# EAGLE design SmHodule-V05 (EAGLE 7.2.0)
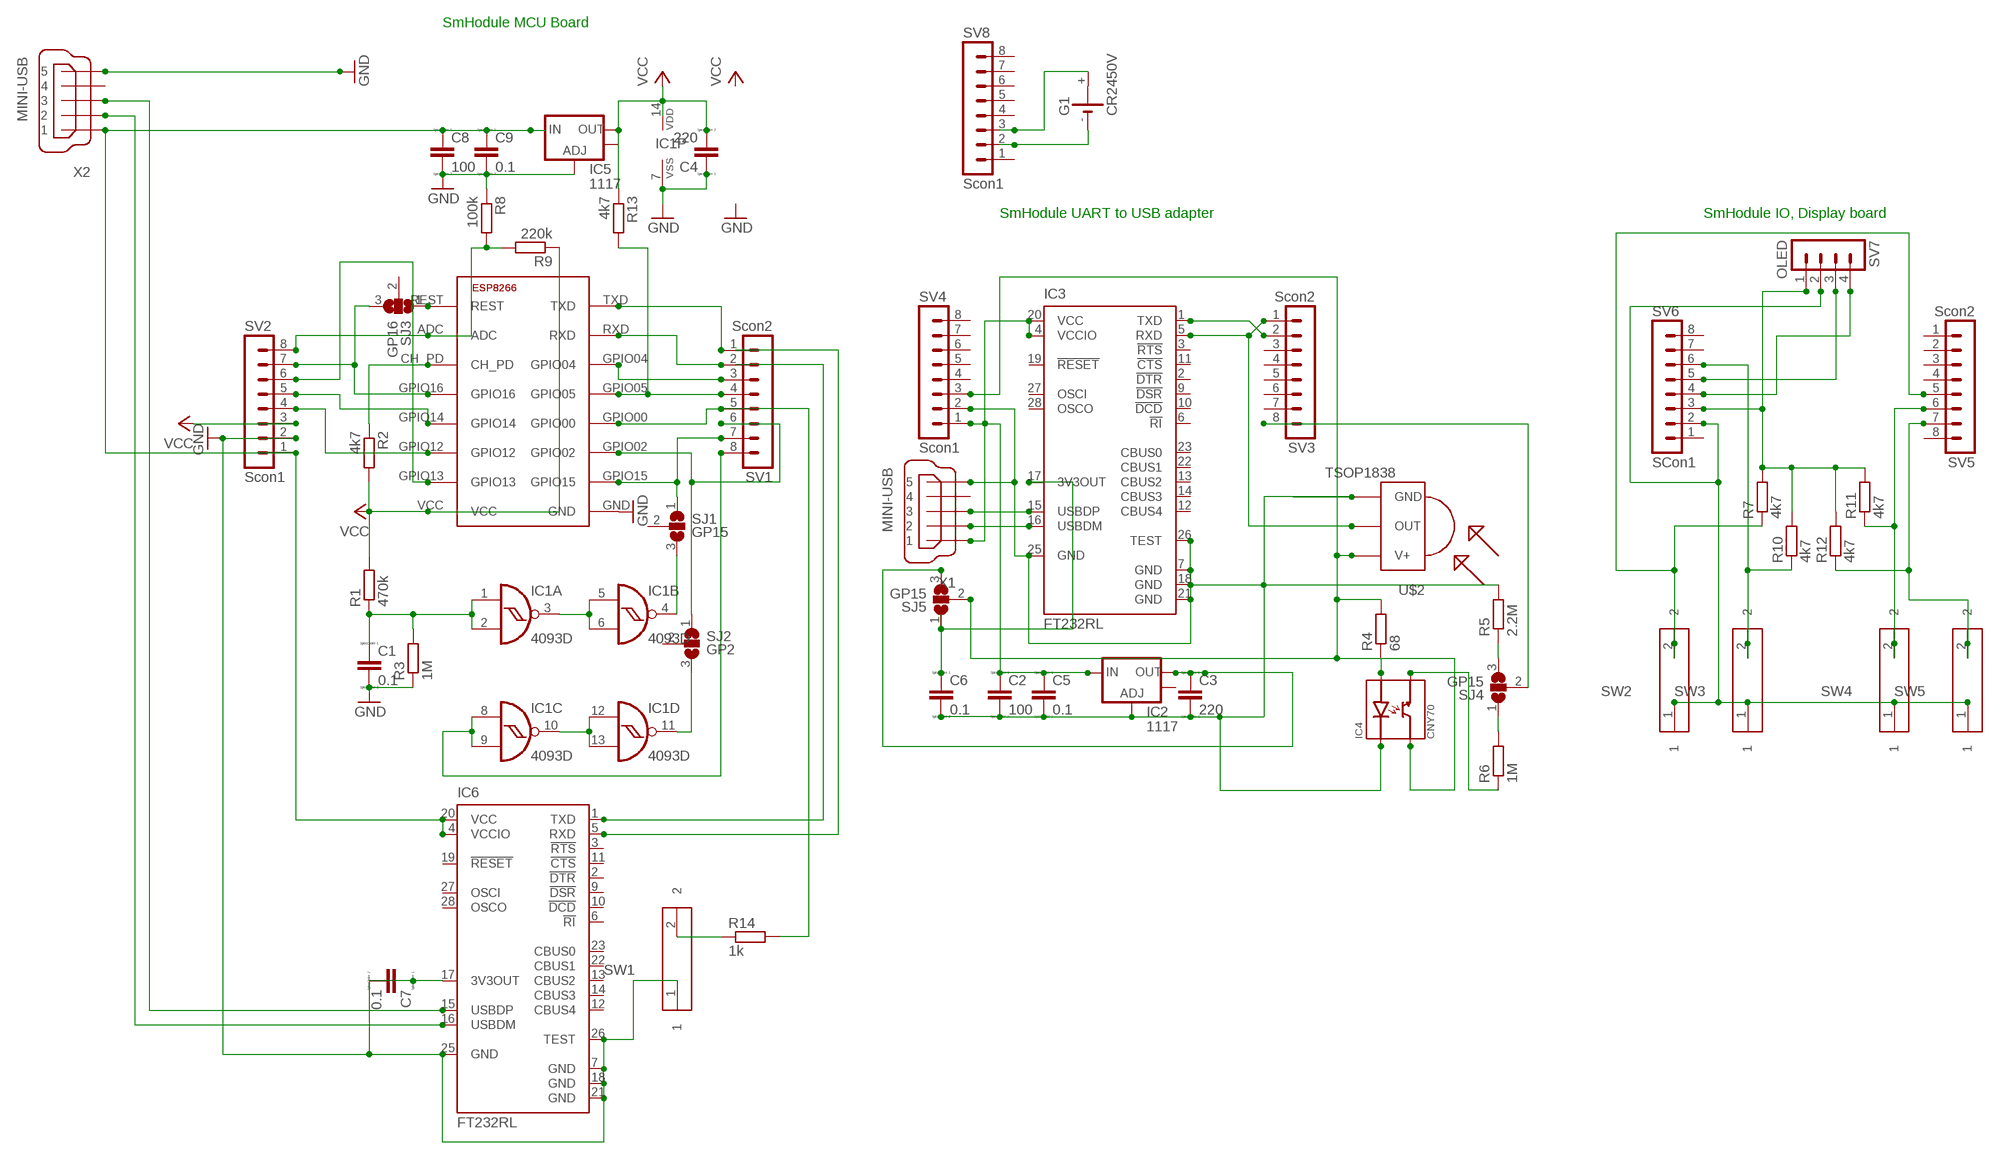
[diagram p0: schematic, sheet 1]

## Parts
C1  0.1  C  [C0805]
C2  100  CC1210  [C1210]
C3  220  CC1210  [C1210]
C4  220  CC1210  [C1210]
C5  0.1  C  [C0805]
C6  0.1  C  [C0805]
C7  0.1  C  [C0805]
C8  100  CC1210  [C1210]
C9  0.1  C  [C0805]
G1  CR2450V  [CR2450V]
IC1  4093D  [SO14]
IC2  1117  V_REG_LM1117SOT223  [SOT223]
IC3  FT232RL  [SSOP28]
IC4  CNY70  [CNY70]
IC5  1117  V_REG_LM1117SOT223  [SOT223]
IC6  FT232RL  [SSOP28]
R1  470k  R-EU_R0603  [R0603]
R2  4k7  R-EU_R0603  [R0603]
R3  1M  R-EU_R0603  [R0603]
R4  68  R-EU_R0603  [R0603]
R5  2.2M  R-EU_R0603  [R0603]
R6  1M  R-EU_R0603  [R0603]
R7  4k7  R-EU_R0603  [R0603]
R8  100k  R-EU_R0603  [R0603]
R9  220k  R-EU_R0603  [R0603]
R10  4k7  R-EU_R0603  [R0603]
R11  4k7  R-EU_R0603  [R0603]
R12  4k7  R-EU_R0603  [R0603]
R13  4k7  R-EU_R0603  [R0603]
R14  1k  R-EU_R0603  [R0603]
SJ1  GP15  SJ2W  [SJ_2]
SJ2  GP2  SJ2W  [SJ_2]
SJ3  GP16  SJ2W  [SJ_2]
SJ4  GP15  SJ2W  [SJ_2]
SJ5  GP15  SJ2W  [SJ_2]
SV1  Scon2  MA08-1  [MA08-1]
SV2  Scon1  MA08-1  [MA08-1]
SV3  Scon2  MA08-1  [MA08-1]
SV4  Scon1  MA08-1  [MA08-1]
SV5  Scon2  MA08-1  [MA08-1]
SV6  SCon1  MA08-1  [MA08-1]
SV7  OLED  MA04-1  [MA04-1]
SV8  Scon1  MA08-1  [MA08-1]
SW1  434111043826  [434111043826]
SW2  434111043826  [434111043826]
SW3  434111043826  [434111043826]
SW4  434111043826  [434111043826]
SW5  434111043826  [434111043826]
U$1  ESP1  ESP8266ESP-12  [ESP-12]
U$2  TSOP1838  [TSOP18XX]
X1  MINI-USB  MINI-USB-SHIELD-UX60-MB-5ST  [UX60-MB-5ST]
X2  MINI-USB  MINI-USB-SHIELD-UX60-MB-5ST  [UX60-MB-5ST]

## Nets
GND: C1.2 C4.1 C7.2 C8.2 C9.2 IC1.7(P:VSS) IC5.1(ADJ) IC6.7(GND) IC6.18(GND) IC6.21(GND) IC6.25(GND) IC6.26(TEST) R3.1 R8.1 SV2.2 SW1.1 U$1.GND X2.5
N$1: C1.1 IC1.1(A:I0) IC1.2(A:I1) R1.1 R3.2
N$2: IC1.3(A:O) IC1.5(B:I0) IC1.6(B:I1)
N$3: IC3.1(TXD) SV3.2
N$4: IC1.10(C:O) IC1.12(D:I0) IC1.13(D:I1)
N$6: IC1.4(B:O) SJ1.3
N$7: SV1.1 U$1.TXD
N$8: SV1.2 U$1.RXD
N$9: SV2.6 U$1.GPIO13
N$10: R14.2 SV1.5 U$1.GPIO00
N$11: SV2.4 U$1.GPIO12
N$12: SV2.5 U$1.GPIO14
N$13: SV1.3 U$1.GPIO04
N$14: R13.2 SV1.4 U$1.GPIO05
N$15: SJ3.3 SV2.7 U$1.GPIO16
N$16: R6.2 SJ4.1
N$17: R8.2 R9.2 SV2.8 U$1.ADC
N$18: R2.1 U$1.CH_PD
N$20: SJ1.1 SV1.7 U$1.GPIO15
N$21: IC3.5(RXD) SV3.1 U$2.OUT
N$22: C2.2 C3.2 C5.2 C6.2 IC2.1(ADJ) IC3.7(GND) IC3.18(GND) IC3.21(GND) IC3.25(GND) IC3.26(TEST) IC4.EK R5.2 SV4.2 U$2.GND X1.5
N$23: IC1.11(D:O) SJ2.3
N$24: SJ2.1 SV1.6 U$1.GPIO02
N$25: SJ3.1 U$1.REST
N$26: IC1.8(C:I0) IC1.9(C:I1) SV1.8
N$27: IC4.DC R4.2 SJ5.2 SV4.3 U$2.VCC(V+)
N$28: C2.1 C5.1 IC2.3(IN) IC3.4(VCCIO) IC3.20(VCC) SV4.1 X1.1
N$30: R7.2 R10.2 R11.2 R12.2 SV6.3 SV7.1
N$31: R11.1 SV5.6 SW4.2
N$33: IC4.DE R6.1
N$34: R5.1 SJ4.3
N$35: SV6.5 SV7.3
N$36: R10.1 SV6.6 SW3.2
N$37: R14.1 SW1.2
N$38: IC4.EA R4.1
N$39: IC3.16(USBDM) X1.2
N$40: IC3.15(USBDP) X1.3
N$41: C6.1 IC3.17(3V3OUT) SJ5.1
N$42: R7.1 SV5.5 SW2.2
N$43: SV6.4 SV7.4
N$44: R12.1 SV5.7 SW5.2
N$46: C3.1 IC2.2(OUT) SJ5.3
N$47: SV6.2 SV7.2 SW2.1 SW3.1 SW4.1 SW5.1
N$52: SJ4.2 SV3.8
N$54: G1.- SV8.2
N$55: G1.+ SV8.3
N$57: C8.1 C9.1 IC5.3(IN) IC6.4(VCCIO) IC6.20(VCC) SV2.1 X2.1
N$60: IC6.1(TXD)
N$62: IC6.5(RXD)
N$64: IC6.15(USBDP) X2.3
N$65: IC6.16(USBDM) X2.2
N$66: C7.1 IC6.17(3V3OUT)
VCC: C4.2 IC1.14(P:VDD) IC5.2(OUT) IC5.4(OUT) R1.2 R2.2 R9.1 R13.1 SV2.3 U$1.VCC
Unconnected: G1.+@1(+) IC2.4(OUT) IC3.2(!DTR) IC3.3(!RTS) IC3.6(!RI) IC3.9(!DSR) IC3.10(!DCD) IC3.11(!CTS) IC3.12(CBUS4) IC3.13(CBUS2) IC3.14(CBUS3) IC3.19(!RESET) IC3.22(CBUS1) IC3.23(CBUS0) IC3.27(OSCI) IC3.28(OSCO) IC6.2(!DTR) IC6.3(!RTS) IC6.6(!RI) IC6.9(!DSR) IC6.10(!DCD) IC6.11(!CTS) IC6.12(CBUS4) IC6.13(CBUS2) IC6.14(CBUS3) IC6.19(!RESET) IC6.22(CBUS1) IC6.23(CBUS0) IC6.27(OSCI) IC6.28(OSCO) SJ1.2 SJ2.2 SJ3.2 SV3.3 SV3.4 SV3.5 SV3.6 SV3.7 SV4.4 SV4.5 SV4.6 SV4.7 SV4.8 SV5.1 SV5.2 SV5.3 SV5.4 SV5.8 SV6.1 SV6.7 SV6.8 SV8.1 SV8.4 SV8.5 SV8.6 SV8.7 SV8.8 X1.4 X1.M1(S1) X1.M2(S2) X1.M3(S3) X1.M4(S4) X2.4 X2.M1(S1) X2.M2(S2) X2.M3(S3) X2.M4(S4)

## Notes on the sheet
- SmHodule MCU Board
- SmHodule UART to USB adapter | SmHodule IO, Display board

## Library data of the parts
C1-C9 = ESP07_CUSTOM:C: CAPACITOR, European symbol; SPICEMODEL: NONE; SPICEPREFIX: C
G1 = battery:CR2450V: LI BATTERY Varta
IC1 = 40xx:4093: Quad 2-input NAND schmitt trigger
IC2 IC5 = ESP07_CUSTOM:V_REG_LM1117: Voltage Regulator LM1117 Standard adjustable voltage regulator but in SMD form. Spark Fun Electronics SKU : COM-00595; PROD_ID: VREG-08170
IC3 IC6 = ftdichip:FT232R: Source: http://www.ftdichip.com/Documents/DataSheets/DS_FT232R_v104.pdf; MPN: FT232RL; OC_FARNELL: 1146032; OC_NEWARK: 91K9918
IC4 = CNY70:CNY70: CNY70 (Vishay) Reflexkoppler
R1-R14 = ESP07_CUSTOM:R-EU_: RESISTOR, European symbol
SJ1-SJ5 = ESP07_CUSTOM:SJ2W: SMD solder JUMPER
SV1-SV6 SV8 = ESP07_CUSTOM:MA08-1: PIN HEADER; OC_FARNELL: unknown; OC_NEWARK: unknown
SV7 = con-lstb:MA04-1: PIN HEADER; OC_FARNELL: unknown; OC_NEWARK: unknown
SW1-SW5 = Kurzhubtaster:434111043826: WS-TRS-6x3.5 mm SMD Tact Switch, 2 pins
U$1 = ESP8266-12:ESP8266: low cost Wifi to Serial Module
U$2 = tsop:TSOP1838: IR Receiver and Demodulator
X1 X2 = con-hirose:MINI-USB-SHIELD-: MINI USB Connector Source: http://www.hirose.co.jp/cataloge_hp/e24000019.pdf; OC_FARNELL: unknown; OC_NEWARK: unknown

## Board
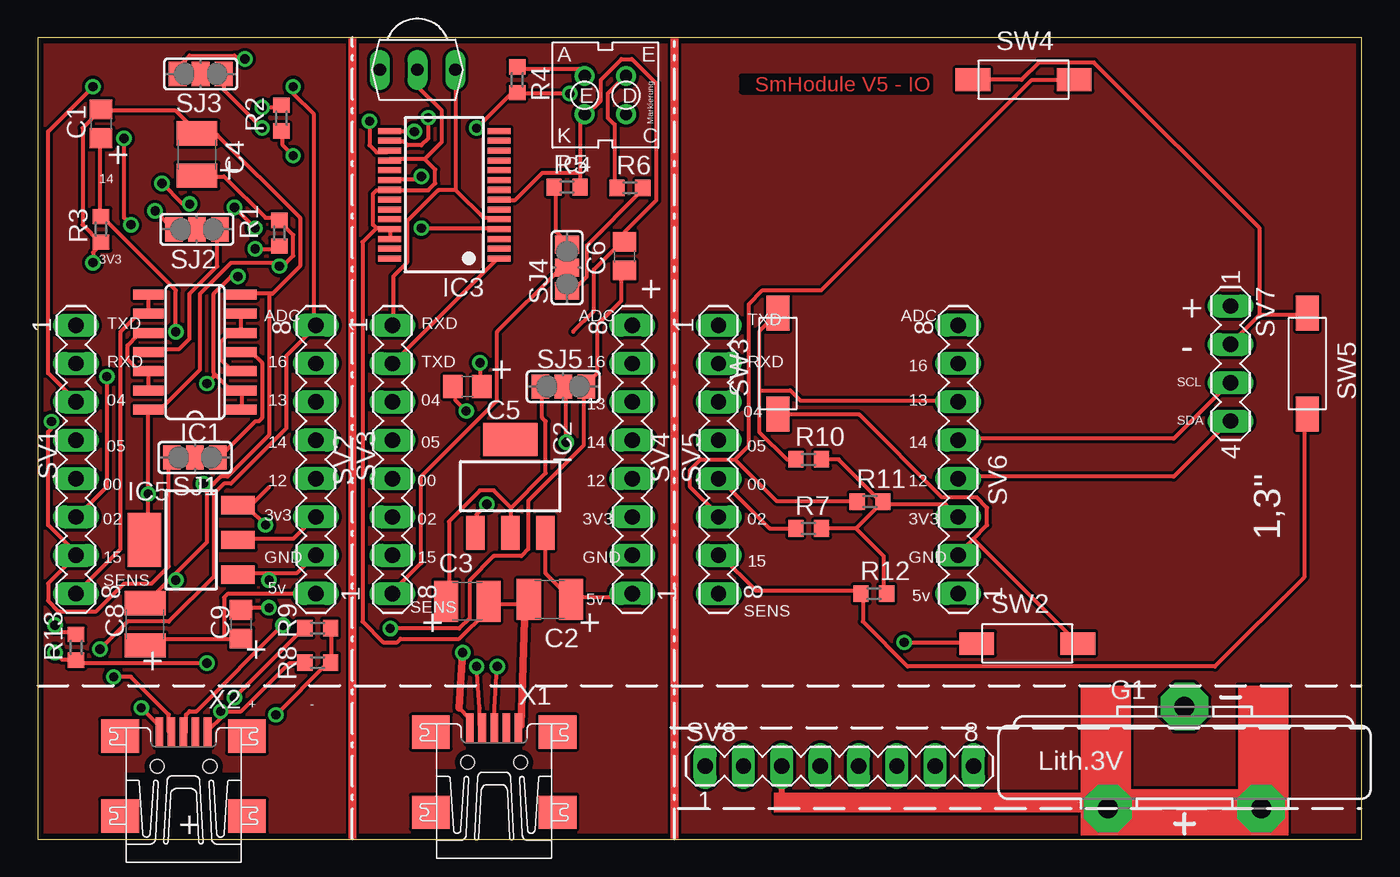
[diagram p1: board, top side]
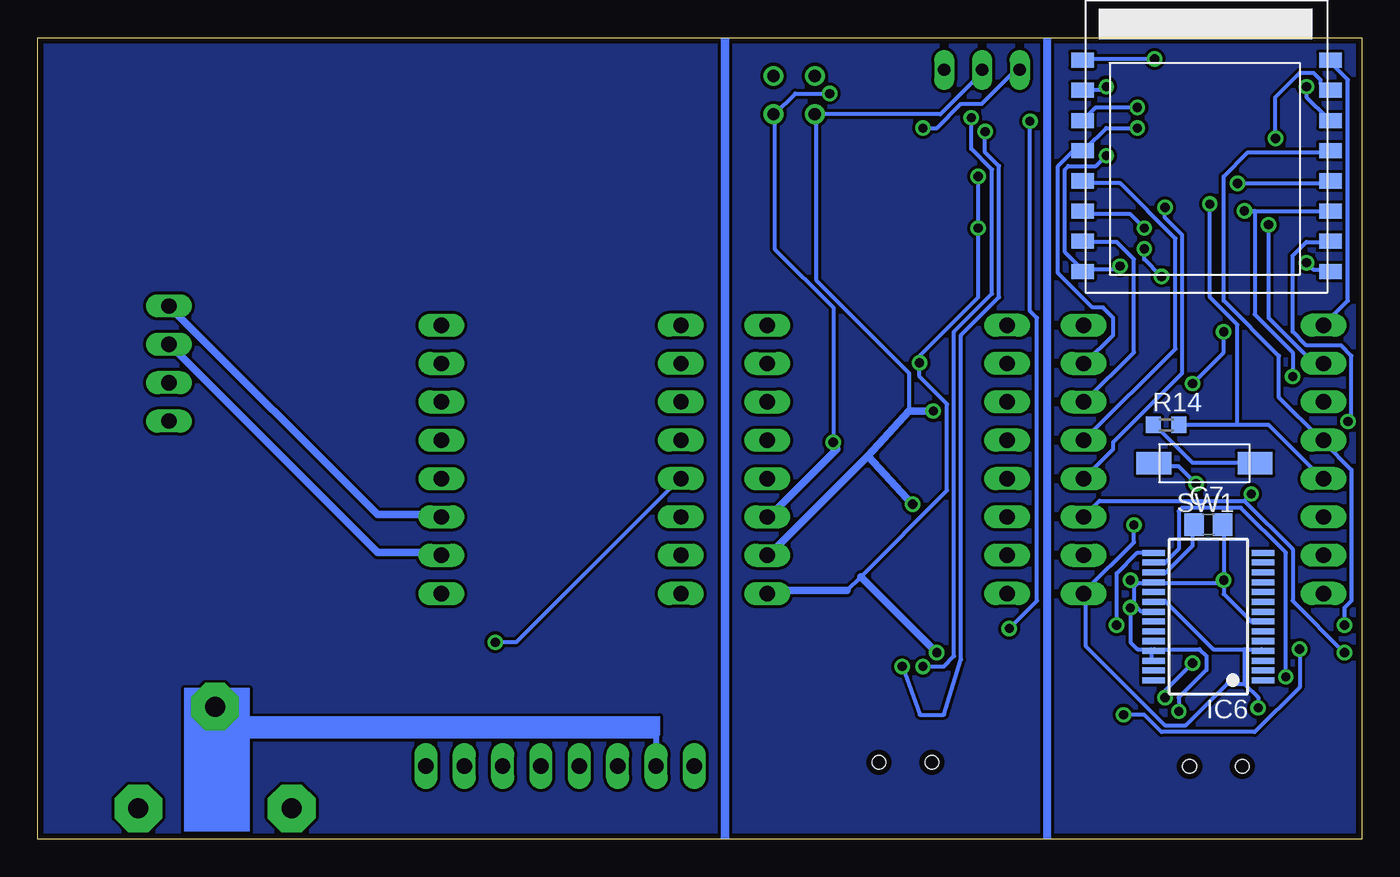
[diagram p2: board, bottom side, seen from below]

Size 87.68 x 53.08 mm. Coordinates in mm from the lower left corner, seen from the top.
Outline: 0,0 87.68,0 87.68,53.08 0,53.08 0,0
Copper layers (1*16): Top 0.0025mm / dielectric 1.5mm / Bottom 0.0025mm
Design rules "default *": minimum track width 10mil, minimum drill 24mil, track to track 8mil, track to pad 8mil, pad to pad 8mil, via to via 8mil, smd to smd 8mil, copper to edge 15mil, drill to drill 8mil, minimum pad ring 10mil, minimum via ring 8mil, stop-mask expansion 4mil, vias tented up to drill 0mil, thermal gap 10mil

### Footprints (pad centres in the part's own frame; a part is rotated, then mirrored left to right if it is on the bottom)
C0805 = smd 1.3 x 1.5: 1 -0.95,0; 2 0.95,0
C1210 = smd 1.6 x 2.7: 1 -1.4,0; 2 1.4,0
CR2450V = drill 1.321 pad 3.15 octagon: + -2.54,-5.08; +@1 -2.54,5.08; - 4.191,0
SO14 = smd 0.66 x 2.032: 1 -3.81,-3.073; 2 -2.54,-3.073; 3 -1.27,-3.073; 4 0,-3.073; 5 1.27,-3.073; 6 2.54,-3.073; 7 3.81,-3.073; 8 3.81,3.073; 9 2.54,3.073; 10 1.27,3.073; 11 0,3.073; 12 -1.27,3.073; 13 -2.54,3.073; 14 -3.81,3.073
SOT223 = smd 1.219 x 2.235: 1 -2.311,-3.099; 2 0,-3.099; 3 2.311,-3.099 | smd 3.6 x 2.2: 4 0,3.099
SSOP28 = smd 0.4 x 1.5: 1 -4.225,-3.625; 2 -3.575,-3.625; 3 -2.925,-3.625; 4 -2.275,-3.625; 5 -1.625,-3.625; 6 -0.975,-3.625; 7 -0.325,-3.625; 8 0.325,-3.625; 9 0.975,-3.625; 10 1.625,-3.625; 11 2.275,-3.625; 12 2.925,-3.625; 13 3.575,-3.625; 14 4.225,-3.625; 15 4.225,3.625; 16 3.575,3.625; 17 2.925,3.625; 18 2.275,3.625; 19 1.625,3.625; 20 0.975,3.625; 21 0.325,3.625; 22 -0.325,3.625; 23 -0.975,3.625; 24 -1.625,3.625; 25 -2.275,3.625; 26 -2.925,3.625; 27 -3.575,3.625; 28 -4.225,3.625
CNY70 = drill 0.813: DC 1.37,-1.27; DE 1.37,1.27; EA -1.37,1.27; EK -1.37,-1.27
R0603 = smd 1 x 1.1: 1 -0.85,0; 2 0.85,0
SJ_2 = smd 1.168 x 1.6: 1 -1.524,0; 2 0,0; 3 1.524,0
MA08-1 = drill 1.016 long: 1 -8.89,0; 2 -6.35,0; 3 -3.81,0; 4 -1.27,0; 5 1.27,0; 6 3.81,0; 7 6.35,0; 8 8.89,0
MA04-1 = drill 1.016 long: 1 -3.81,0; 2 -1.27,0; 3 1.27,0; 4 3.81,0
434111043826 = smd 2.3 x 1.5: 1 -3.35,0; 2 3.35,0
ESP-12 = smd 1 x 1.5: ADC 4,-0.2; CH_PD 6,-0.2; GND 16,16.21; GPIO00 10,16.21; GPIO02 12,16.21; GPIO04 6,16.21; GPIO05 8,16.21; GPIO12 12,-0.2; GPIO13 14,-0.2; GPIO14 10,-0.2; GPIO15 14,16.21; GPIO16 8,-0.2; REST 2,-0.2; RXD 4,16.21; TXD 2,16.21; VCC 16,-0.2
TSOP18XX = drill 0.813 long: GND -0.001,-0.027; OUT -2.501,-0.027; VCC 2.499,-0.027
UX60-MB-5ST = smd 2 x 0.5: 1 2.25,1.6; 2 2.25,0.8; 3 2.25,0; 4 2.25,-0.8; 5 2.25,-1.6 | smd 2.2 x 2.5: M1 -3.3,-4.2; M2 -3.3,4.2; M3 2,4.2; M4 2,-4.2 | hole 0.9: 0,-1.75; 0,1.75

### Placement (x,y rotation side)
C1  4.19,47.37 90 top
C2  33.91,15.87 180 top
C3  28.45,15.75 0 top
C4  10.54,45.34 270 top
C5  28.45,29.97 180 top
C6  38.86,38.61 90 top
C7  10.16,20.83 0 bottom
C8  7.11,14.22 90 top
C9  13.46,14.22 90 top
G1  75.95,4.57 90 top
IC1  10.41,32.26 90 top
IC2  31.29,23.37 0 top
IC3  26.92,42.67 90 top
IC4  37.59,49.28 0 top
IC5  10.16,19.81 90 top
IC6  10.16,14.73 90 bottom
R1  16,40.13 90 top
R2  16.13,47.75 270 top
R3  4.19,40.39 90 top
R4  31.75,50.29 270 top
R5  35.05,43.18 0 top
R6  39.22,43.13 0 top
R7  51.05,20.57 0 top
R8  18.54,11.68 0 top
R9  18.54,13.97 0 top
R10  51.05,25.15 0 top
R11  55.12,22.35 0 top
R12  55.37,16.26 0 top
R13  2.54,12.7 90 top
R14  12.95,27.43 0 bottom
SJ1  10.41,25.27 0 top
SJ2  10.54,40.39 0 top
SJ3  10.79,50.67 0 top
SJ4  35.05,37.85 90 top
SJ5  34.8,29.97 180 top
SV1  2.54,25.15 270 top
SV2  18.41,25.15 90 top
SV3  23.5,25.15 270 top
SV4  39.37,25.15 90 top
SV5  45.09,25.15 270 top
SV6  60.96,25.15 90 top
SV7  78.99,31.5 270 top
SV8  53.09,4.83 0 top
SW1  10.41,24.89 0 bottom
SW2  65.53,12.95 180 top
SW3  49.02,31.5 90 top
SW4  65.28,50.29 0 top
SW5  84.07,31.5 270 top
U$1  18.29,53.59 270 bottom
U$2  25.15,50.93 180 top
X1  30.23,5.08 90 top
X2  9.65,4.83 90 top

### Tracks (layer width: path | path; a pad name or v marks a point on that pad's centre or on a via)
GND  (via drill 0.61)
  Top 0.254: 12.34,8.23 11.2,7.09 X2.5 | 12.34,8.23 12.57,8.46 13.49,8.46 16.69,11.66 17.6,11.66 R8.1 | 15.32,17.6 17.14,17.6 18.29,18.75 SV2.2 | 15.32,17.6 13.26,17.6 IC5.1 | v15.32,15.32 13.49,15.32 C9.2 | v15.32,17.14 15.32,17.6 | v12.12,8.46 12.34,8.23 | v3.66,38.18 3.66,38.86 4.12,39.32 R3.1 4.12,39.55 2.97,40.69 2.97,47.09 4.12,48.23 C1.2 4.34,48.23 9.14,48.23 10.52,46.86 C4.1 10.74,46.63 11.89,46.63 17.37,41.15 17.37,37.95 15.54,36.12 15.32,36.12 | 15.32,36.12 13.49,36.12 IC1.7 | 8.91,17.37 11.2,19.66 11.2,23.09 11.66,23.55 | 8.91,17.37 7.32,15.77 C8.2 | 11.66,23.55 12.12,24 12.57,24 15.32,26.75 15.32,36.12 | 8.91,17.37 v9.14,17.14 | 11.66,23.55 v10.97,23.55
  Bottom 0.254: IC6.26 13.95,11.89 13.95,12.34 IC6.25 | 15.09,15.54 14.63,15.09 13.95,15.09 IC6.21 | 15.09,15.54 15.09,16.69 14.86,16.92 | 14.86,16.92 13.95,16.92 IC6.18 13.72,16.92 9.14,16.92 | 15.09,15.54 v15.32,15.32 15.32,13.03 14.86,12.57 13.95,12.57 IC6.25 | 9.14,16.92 v9.14,17.14 9.14,20.8 C7.2 | 9.14,16.92 9.14,16.23 7.32,14.4 6.63,14.4 IC6.7 | v15.32,17.14 15.09,17.14 14.86,16.92 | v12.12,8.46 12.12,9.37 10.29,11.2 10.29,12.12 10.74,12.57 13.72,12.57 IC6.25 | v3.66,38.18 3.2,37.72 2.29,37.72 U$1.GND | v10.97,23.55 12.12,24.69 13.72,24.69 SW1.1
N$1  (via drill 0.61)
  Top 0.254: IC1.1 13.51,28.57 13.51,29.72 IC1.2 12.8,29.72 11.66,30.86 | C1.1 4.12,46.41 4.12,41.38 R3.2 4.34,41.15 9.14,36.35 v9.14,33.6 | v14.4,39.09 16,39.09 R1.1 | v13.26,37.26 12.8,37.26 11.66,36.12 11.66,30.86 | v11.2,30.18 11.66,30.63 11.66,30.86
  Bottom 0.254: v14.4,39.09 14.4,38.41 v13.26,37.26 | v9.14,33.6 9.14,32.23 v11.2,30.18
N$2
  Top 0.254: IC1.3 13.49,31.09 12.8,31.09 12.12,31.77 12.12,32.92 12.57,33.38 13.49,33.38 IC1.5 IC1.6
N$3
  Top 0.254: SV3.2 30.4,38.41 IC3.1
N$4
  Top 0.254: IC1.13 7.32,29.72 7.32,30.86 IC1.12 7.32,31.09 6.63,31.09 5.94,31.77 5.94,32.69 6.63,33.38 7.32,33.38 IC1.10
N$6
  Top 0.254: SJ1.3 12.12,25.38 14.4,27.66 14.63,27.66 14.86,27.89 14.86,31.55 14.17,32.23 13.49,32.23 IC1.4
N$7
  Bottom 0.254: SV1.1 0.91,35.66 0.91,50.29 2.06,51.44 U$1.TXD
N$8  (via drill 0.61)
  Top 0.254: v5.71,46.41 5.71,41.15 v6.17,40.69
  Bottom 0.254: v5.71,46.41 5.71,49.15 4.12,50.75 3.2,50.75 2.74,50.29 2.74,50.06 2.29,49.61 U$1.RXD | v6.17,40.69 6.17,34.52 3.2,31.55 2.74,31.55 SV1.2
N$9
  Bottom 0.254: U$1.GPIO13 18.29,39.55 16.23,39.55 15.09,38.41 15.09,32.23 18.29,29.03 SV2.6
N$10  (via drill 0.61)
  Top 0.254: v8.23,43.43 9.6,42.06 v10.06,42.06
  Bottom 0.254: v8.23,43.43 2.29,43.43 U$1.GPIO00 | 8.23,27.43 6.17,27.43 2.74,24 SV1.5 | 8.23,27.43 R14.2 | v10.06,42.06 10.06,35.89 8.23,34.06 8.23,27.43
N$11  (via drill 0.61)
  Top 0.254: v13.03,41.83 v14.4,40.46
  Bottom 0.254: v14.4,40.46 15.32,41.38 18.29,41.38 U$1.GPIO12 | v13.03,41.83 13.03,41.15 11.89,40.01 11.89,30.86 16.46,26.29 16.46,25.83 SV2.4
N$12
  Bottom 0.254: U$1.GPIO14 18.29,43.43 16,43.43 12.34,39.78 12.34,32.46 18.29,26.52 SV2.5
N$13  (via drill 0.61)
  Top 0.254: v3.66,49.84 0.69,46.86 0.69,30.86 2.52,29.03 SV1.3
  Bottom 0.254: v3.66,49.84 3.66,49.15 2.29,47.78 U$1.GPIO04
N$14  (via drill 0.61)
  Top 0.254: v1.14,14.17 1.6,13.72 2.52,13.72 R13.2
  Bottom 0.254: v1.14,14.17 1.14,15.32 0.69,15.77 0.69,24.46 2.52,26.29 SV1.4 2.74,26.52 5.49,29.26 5.49,32 9.14,35.66 9.14,43.89 7.54,45.49 2.29,45.49 U$1.GPIO05
N$15  (via drill 0.61)
  Top 0.254: v14.86,47.09 12.34,49.61 12.34,50.52 SJ3.3
  Bottom 0.254: SV2.7 18.29,31.55 16.46,33.38 16.46,34.52 17.14,35.2 17.83,35.2 20.12,37.49 20.12,44.58 19.2,45.49 18.52,45.49 U$1.GPIO16 18.29,45.72 16.92,47.09 v14.86,47.09
N$16
  Top 0.254: R6.2 40.03,42.98 36.37,39.32 36.37,37.26 35.23,36.12 SJ4.1
N$17  (via drill 0.61)
  Top 0.254: R9.2 19.43,13.95 19.43,11.89 R8.2 19.2,11.66 v15.77,8.23 | v16.92,49.84 16.92,49.38 18.29,48.01 18.29,34.06 SV2.8 18.29,33.83 16.46,32 16.46,27.2 12.8,23.55 12.34,23.55 11.66,22.86 11.66,17.37 8.69,14.4 5.94,14.4 v4.12,12.57
  Bottom 0.254: v16.92,49.84 17.14,49.61 18.29,49.61 U$1.ADC | v15.77,8.23 14.4,8.23 13.26,7.09 7.09,7.09 4.12,10.06 v4.12,12.57
N$18  (via drill 0.61)
  Top 0.254: v14.86,48.46 16,48.46 R2.1
  Bottom 0.254: v14.86,48.46 17.6,48.46 18.29,47.78 U$1.CH_PD
N$20  (via drill 0.61)
  Top 0.254: v0.91,27.66 0.91,27.2 0.69,26.98 0.69,20.8 2.52,18.97 SV1.7 2.52,18.75 0.69,16.92 0.69,15.77 1.37,15.09 3.89,15.09 5.71,16.92 7.54,16.92 8.69,18.06 8.69,25.15 SJ1.1
  Bottom 0.254: v0.91,27.66 0.69,27.89 0.69,32 1.37,32.69 3.66,32.69 4.57,33.6 4.57,38.63 3.66,39.55 2.29,39.55 U$1.GPIO15
N$21
  Top 0.254: 27.69,42.98 29.52,41.15 30.43,41.15 IC3.5 | 27.69,42.98 27.69,50.75 U$2.OUT | 27.69,42.98 26.52,42.98 24.46,40.92 24.46,38.18 23.55,37.26 23.55,34.06 SV3.1
N$22  (via drill 0.61)
  Top 0.254: v28.37,28.35 27.69,29.03 27.69,29.95 C5.2 | v29.74,22.17 29.06,21.49 29.06,20.34 IC2.1 | 35.46,33.6 36.83,34.98 36.83,37.72 38.66,39.55 C6.2 38.89,39.78 38.89,40.23 40.95,42.29 40.95,50.06 39.34,51.66 38.66,51.66 37.29,50.29 37.29,48.92 36.37,48.01 IC4.EK 36.14,48.01 35.92,47.78 35.92,44.12 | 35.92,44.12 35.92,43.2 R5.2 | 35.92,44.12 33.4,44.12 31.57,42.29 30.66,42.29 IC3.7 | 32.26,15.54 32.49,15.77 C2.2 32.26,15.54 | 32,7.54 X1.5 | 32.26,15.54 29.97,15.54 C3.2 29.74,15.54 29.74,15.09 27.91,13.26 24.03,13.26 23.8,13.03 22.89,13.03 21.51,14.4 21.51,39.55 22.43,40.46 | IC3.26 23.34,39.78 23.34,40.23 IC3.25 23.11,40.46 22.43,40.46 | 22.43,40.46 22.2,40.69 22.2,42.75 22.43,42.98 23.11,42.98 IC3.21 23.34,42.98 25.86,42.98 26.31,43.43 26.31,44.35 25.63,45.03 | 25.63,45.03 23.34,45.03 IC3.18 | 25.63,45.03 26.77,46.18 26.77,48.23 25.17,49.84 25.17,50.75 U$2.GND
  Top 0.5: 32.26,15.54 32,7.54
  Bottom 0.254: 39.09,18.97 SV4.2 | 29.97,28.35 29.97,30.86 36.14,37.03 36.14,48.01 | 36.14,48.01 27.91,48.01 25.17,50.75 U$2.GND | 36.14,48.01 IC4.EK
  Bottom 0.5: v28.37,28.35 29.97,28.35 32.69,25.38 | 39.09,18.97 32.69,25.38 | 32.69,25.38 v29.74,22.17
N$23
  Top 0.254: SJ2.3 11.89,40.23 11.89,37.95 10.06,36.12 10.06,33.15 9.37,32.46 7.54,32.46 IC1.11
N$24  (via drill 0.61)
  Top 0.254: v7.77,41.6 8.91,40.46 SJ2.1 | v4.57,30.63 4.57,23.32 2.74,21.49 SV1.6
  Bottom 0.254: v7.77,41.6 7.09,41.6 | 7.09,41.6 2.29,41.6 U$1.GPIO02 | v4.57,30.63 4.57,32.23 7.09,34.75 7.09,41.6
N$25  (via drill 0.61)
  Top 0.254: v13.72,51.66 13.26,51.66 13.03,51.89 10.06,51.89 9.37,51.21 9.37,50.75 SJ3.1
  Bottom 0.254: v13.72,51.66 18.29,51.66 U$1.REST
N$26
  Top 0.254: IC1.8 7.32,35.89 7.32,34.98 IC1.9 7.32,34.75 6.63,34.75 5.49,33.6 5.49,19.2 SV1.8
N$27  (via drill 0.61)
  Top 0.254: v35,26.29 35,29.95 SJ5.2 | v35.23,49.38 31.8,49.38 R4.2 31.57,49.61 v29.06,47.09
  Top 0.406: 33.02,29.97 SJ5.2
  Bottom 0.254: 34.75,25.83 v35,26.29 35,35.2 38.89,39.09 38.89,48.01 | 39.09,21.49 SV4.3 | v35.23,49.38 37.52,49.38 38.89,48.01 | v29.06,47.09 28.14,47.09 26.54,48.69 25.17,48.69 23.11,50.75 22.66,50.75 U$2.VCC | 38.89,48.01 IC4.DC
  Bottom 0.5: 39.09,21.49 34.75,25.83
N$28  (via drill 0.61)
  Top 0.254: IC2.3 33.63,20.12 33.63,17.6 35.23,16 C2.1 35.46,16 39.12,16 SV4.1 | v29.29,31.55 29.29,30.18 C5.1 | v25.4,43.89 25.17,43.66 23.34,43.66 IC3.20 | v25.4,40.46 30.43,40.46 IC3.4 | 27.89,8.69 28.57,8 28.57,7.54 X1.1
  Top 0.5: v28.14,12.34 27.89,8.69
  Bottom 0.254: 34.09,16.46 33.17,17.37 27.46,23.09 27.46,28.8 29.29,30.63 v29.29,31.55 29.29,32 25.4,35.89 v25.4,40.46 v25.4,43.89 | 39.34,16.46 SV4.1
  Bottom 0.5: 39.34,16.46 34.09,16.46 | 33.17,17.37 v28.14,12.34
N$29
  pour Bottom: 0,53.09 87.63,53.09 87.63,0 0,0
N$30
  Top 0.254: 54.18,20.57 R7.2 | 54.18,20.57 55.78,22.17 R11.2 | R10.2 53.03,25.15 55.78,22.4 R11.2 | 54.18,20.57 56.01,18.75 56.01,16.46 R12.2 | SV6.3 60.12,22.17 56.01,22.17 R11.2
  Bottom 0.254: 61.06,21.49 SV6.3
  Bottom 0.5: 61.06,21.49 65.18,21.49 SV7.1
N$31
  Top 0.254: 46.18,25.15 48.92,22.4 54.18,22.4 R11.1 | 46.18,25.15 43.89,25.15 43.2,24.46 43.2,23.32 45.03,21.49 SV5.6 | SW4.2 65.84,50.29 51.89,36.35 48.01,36.35 47.09,35.43 47.09,26.06 46.18,25.15
N$33
  Top 0.254: R6.1 38.2,43.2 38.2,47.32 37.74,47.78 37.74,49.38 38.89,50.52 IC4.DE
N$34
  Top 0.254: R5.1 34.31,42.98 34.31,40.23 35,39.55 SJ4.3
N$35
  Top 0.254: SV6.5 61.06,26.52 75.23,26.52 78.89,30.18 SV7.3
N$36
  Top 0.254: R10.1 49.61,25.15 47.78,26.98 47.78,29.72 | 47.78,29.72 47.78,33.6 48.92,34.75 SW3.2 | 47.78,29.72 49.84,29.72 50.52,29.03 60.81,29.03 SV6.6
N$37
  Bottom 0.254: R14.1 13.72,27.43 11.2,24.92 7.09,24.92 SW1.2
N$38
  Top 0.254: R4.1 31.8,50.98 35.92,50.98 36.14,50.75 IC4.EA
N$39  (via drill 0.61)
  Top 0.254: v25.86,47.78 25.86,46.41 25.4,45.95 24.49,45.95 24.26,46.18 23.34,46.18 IC3.16 | v29.06,11.43 29.26,8.69 29.26,7.54 X1.2
  Bottom 0.254: v25.86,47.78 25.86,45.72 24.49,44.35 24.49,36.12 27,33.6 27,12.12 27.69,11.43 v29.06,11.43
N$40  (via drill 0.61)
  Top 0.254: v24.94,46.86 23.34,46.86 IC3.15 | v30.43,11.43 30.18,7.54 X1.3
  Bottom 0.254: v24.94,46.86 24.94,45.49 24.03,44.58 24.03,35.89 26.54,33.38 26.54,11.89 27.66,8.23 29.26,8.23 v30.43,11.43
N$41  (via drill 0.61)
  Top 0.254: v21.97,47.55 21.97,45.95 22.43,45.49 23.11,45.49 IC3.17 | v23.34,13.95 27.91,13.95 28.6,14.63 28.6,17.14 30.2,18.75 32.03,18.75 32.49,19.2 32.49,22.4 36.14,26.06 36.14,29.95 SJ5.1 36.37,30.18 37.06,30.86 37.06,34.06 38.66,35.66 38.66,37.49 C6.1
  Bottom 0.254: v21.97,47.55 21.97,34.98 21.51,34.52 21.51,15.77 v23.34,13.95
N$42  (via drill 0.61)
  Top 0.254: R7.1 48.46,20.57 45.26,23.77 SV5.5 | v57.38,13.03 62.18,13.03 SW2.2
  Bottom 0.254: v57.38,13.03 56.01,13.03 45.26,23.77 SV5.5
N$43
  Top 0.254: SV6.4 61.06,24 75.23,24 78.89,27.66 SV7.4
N$44
  Top 0.254: SV5.7 45.26,18.75 47.55,16.46 54.41,16.46 R12.1 54.63,16.23 54.63,14.4 57.61,11.43 77.95,11.43 83.9,17.37 83.9,28.12 SW5.2
N$46
  Top 0.254: 31.34,21.95 33.63,24.23 33.63,27.66 33.4,27.89 33.4,29.95 SJ5.3 | 31.34,21.95 31.34,20.34 IC2.2 | 31.34,21.95 30.2,23.09 29.29,23.09 27.23,21.03 27.23,15.77 C3.1
N$47
  Top 0.254: 80.94,34.73 79.12,32.92 SV7.2 | 80.94,34.73 80.95,34.75 83.92,34.75 SW5.1 | 61.95,19.89 61.04,18.97 SV6.2 | 61.95,19.89 62.87,20.8 62.87,21.95 62.18,22.63 59.89,22.63 54.41,28.12 49.15,28.12 SW3.1 | SW4.1 65.15,50.29 66.29,51.44 69.95,51.44 80.92,40.46 80.92,34.75 80.94,34.73 | 61.95,19.89 68.81,13.03 SW2.1
  Bottom 0.254: 61.06,18.97 SV6.2 | 78.89,32.69 SV7.2
  Bottom 0.5: 61.06,18.97 65.18,18.97 78.89,32.69
N$52
  Top 0.254: SJ4.2 35,37.72 34.54,37.72 30.43,33.6 30.43,29.03 25.4,24 25.4,18.29 23.57,16.46 SV3.8
  Top 0.406: SJ4.2 35.05,36.07
N$54
  Bottom 0.406: G1.- 75.95,6.86 46.74,6.86 | 46.74,6.86 46.74,7.11 | 46.74,6.86 SV8.2
N$55
  Top 0.406: G1.+ 70.87,1.78 70.87,1.52 71.12,1.52 71.12,2.79 49.28,2.79 | 49.28,2.79 49.28,2.54 | 49.28,2.79 SV8.3
N$56
  pour Top: 0,0 0,53.09 87.63,53.09 87.88,52.83 87.88,0.25 87.63,0
N$57  (via drill 0.61)
  Top 0.254: v6.86,8.69 8,7.54 8,7.09 X2.1 | 12.34,13.26 7.54,13.26 7.32,13.03 C8.1 | 12.34,13.26 13.26,13.26 C9.1 | 13.95,21.95 13.26,21.95 IC5.3 13.95,21.95 | v15.09,20.8 13.95,21.95 | 12.34,13.26 12.34,16 12.57,16.23 18.29,16.23 SV2.1 | 13.95,21.95 15.32,23.32
  Bottom 0.254: 7.77,12.57 9.83,12.57 13.03,15.77 13.72,15.77 IC6.20 | 7.77,12.57 6.63,12.57 IC6.4 | v6.86,8.69 6.86,9.37 7.77,10.29 | 7.77,12.57 7.77,10.29 | v15.09,20.8 15.09,19.66 18.29,16.46 SV2.1 18.29,16.23 18.29,12.8 13.03,7.54 11.66,7.54 8.91,10.29 7.77,10.29
N$59
  Top 0.406: 10.92,40.13 10.92,40.39
N$64  (via drill 0.61)
  Top 0.254: v16.23,14.17 10.52,8.46 10.06,8.46 9.83,8.23 9.83,7.09 X2.3
  Bottom 0.254: v16.23,14.17 16.23,17.6 14.86,18.97 13.95,18.97 IC6.15
N$65  (via drill 0.61)
  Top 0.254: v5.03,10.74 6.17,10.74 8.69,8.23 8.69,7.09 X2.2
  Bottom 0.254: v5.03,10.74 5.03,18.97 8,21.95 11.89,21.95 12.12,21.72 12.12,19.2 13.03,18.29 13.72,18.29 IC6.16
N$66
  Bottom 0.254: C7.1 11.2,20.8 11.2,19.43 13.03,17.6 13.72,17.6 IC6.17
VCC  (via drill 0.61)
  Top 0.254: v1.14,12.34 1.6,11.89 2.52,11.89 R13.1 2.74,11.66 v11.2,11.66 | v13.03,9.37 17.6,13.95 R9.1 | IC5.2 13.26,19.89 16.92,19.89 18.29,21.26 SV2.3 | v16.92,45.26 16.23,45.95 16.23,46.86 R2.2 | C4.2 10.74,43.89 12.34,43.89 15.09,41.15 16,41.15 R1.2 16,40.92 16.92,40.01 16.92,38.63 16.46,38.18 16,38.18 | IC5.4 7.09,19.89 7.32,20.12 v7.32,22.86 7.32,28.35 IC1.14 7.54,28.57 8.23,28.57 10.74,31.09 10.74,36.12 12.8,38.18 16,38.18 | 16,38.18 v16,37.95
  Bottom 0.254: v1.14,12.34 4.57,15.77 4.57,19.2 7.77,22.4 | 7.77,22.4 17.37,22.4 18.29,21.49 SV2.3 | v13.03,9.37 13.03,9.83 v11.2,11.66 | v16.92,45.26 17.6,44.58 19.43,44.58 19.66,44.35 19.66,38.86 18.52,37.72 U$1.VCC 18.29,37.72 16.23,37.72 v16,37.95 | v7.32,22.86 7.77,22.4
(copper drawn outside any net)
  shapes: Bottom area x4, Top area x6

### Text on the board
Top: SmHodule V5 - IO
tPlace: +
tNames: + | 14 | + | 3V3 | + | TXD | ADC | RXD | ADC | TXD | ADC | + | - | RXD | 16 | TXD | 16 | RXD | 16 | + | SCL | 04 | 13 | 04 | 13 | 13 | 04 | SDA | 05 | 14 | 05 | 14 | 05 | 14 | 00 | 12 | 00 | 12 | 00 | 12 | 02 | 3v3 | 02 | 3V3 | 02 | 3V3 | 1,3" | 15 | GND | 15 | GND | 15 | GND | SENS | 5v | 5v | SENS | 5v | SENS | + | + | + | + | + | -